# Altium schematic sheet CPU.SchDoc
size A3; SheetNumber: 3; SheetTotal: 7
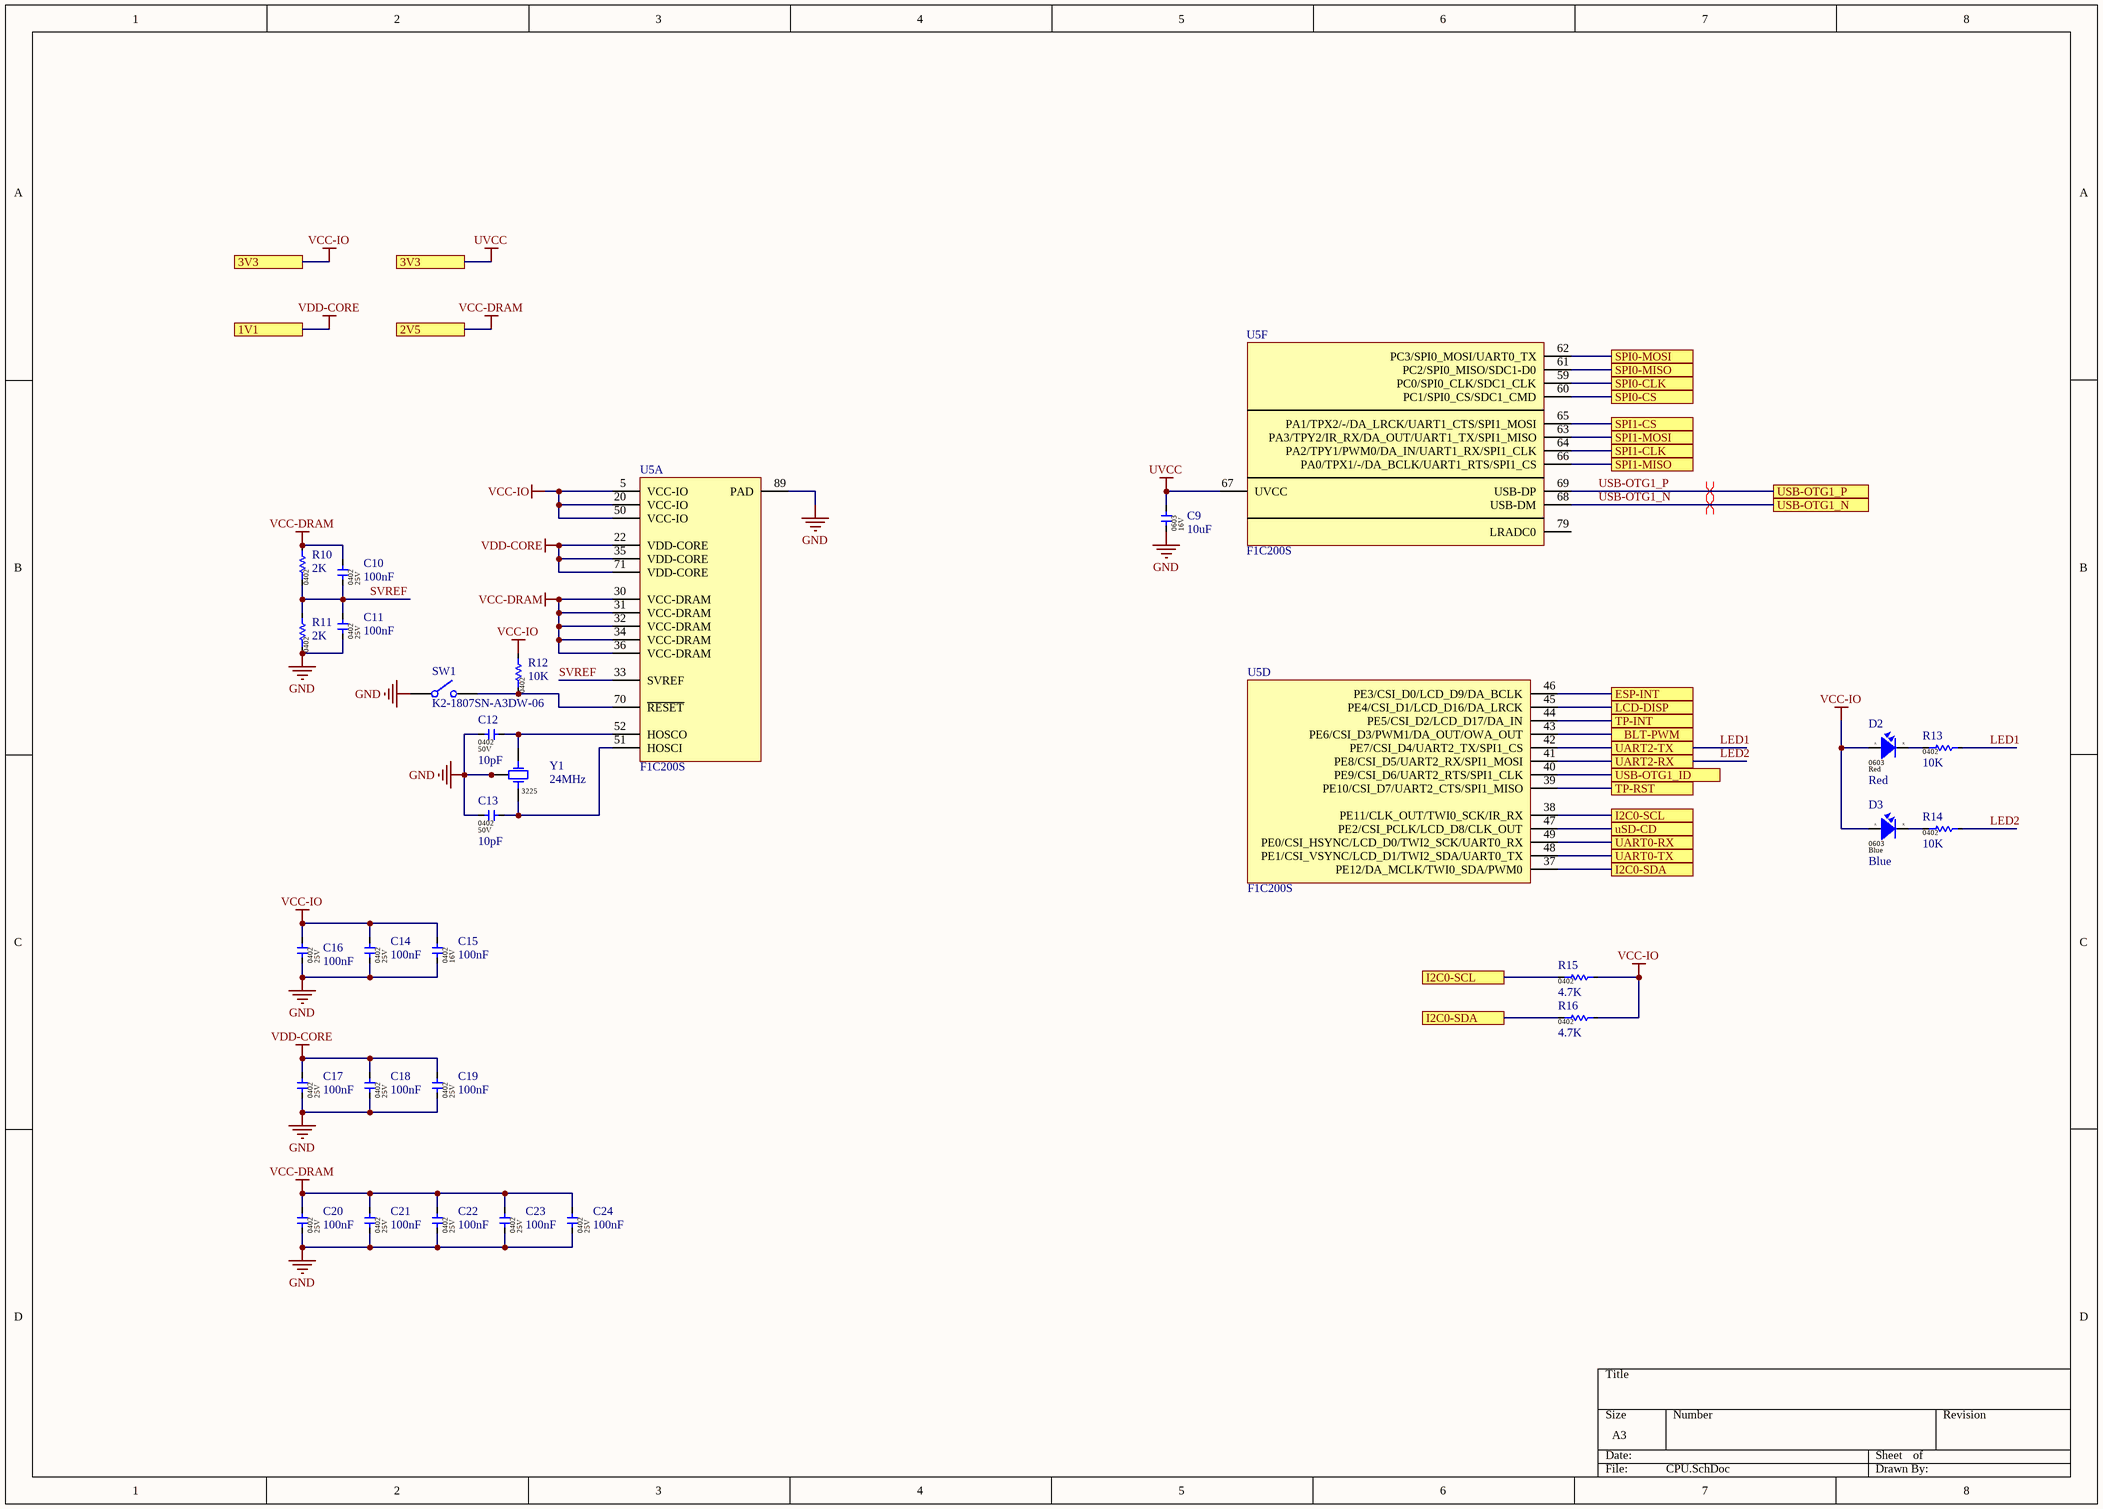
[diagram p0: CPU.SchDoc]

## Parts
C9  10uF  [CAP-0603]
C10  100nF  [CAP-0402]
C11  100nF  [CAP-0402]
C12  10pF  [CAP-0402]
C13  10pF  [CAP-0402]
C14  100nF  [CAP-0402]
C15  100nF  [CAP-0402]
C16  100nF  [CAP-0402]
C17  100nF  [CAP-0402]
C18  100nF  [CAP-0402]
C19  100nF  [CAP-0402]
C20  100nF  [CAP-0402]
C21  100nF  [CAP-0402]
C22  100nF  [CAP-0402]
C23  100nF  [CAP-0402]
C24  100nF  [CAP-0402]
D2  Red  [LED-0603 RED]
D3  Blue  [LED-0603 BLUE]
R10  2K  [RES-0402]
R11  2K  [RES-0402]
R12  10K  [RES-0402]
R13  10K  [RES-0402]
R14  10K  [RES-0402]
R15  4.7K  [RES-0402]
R16  4.7K  [RES-0402]
SW1  K2-1807SN-A3DW-06  [SW - TYPE 3]
U5  F1C200S  [F1Cx00s]  (parts A,D,F of 6)
Y1  24MHz  [Crystal-3225]

## Ports
1V1, 2V5, 3V3, BLT-PWM, ESP-INT, I2C0-SCL, I2C0-SDA, LCD-DISP, SPI0-CLK, SPI0-CS, SPI0-MISO, SPI0-MOSI, SPI1-CLK, SPI1-CS, SPI1-MISO, SPI1-MOSI, TP-INT, TP-RST, UART0-RX, UART0-TX, UART2-RX, UART2-TX, USB-OTG1_ID, USB-OTG1_N, USB-OTG1_P, uSD-CD

## Nets
GND: C9.1 C11.1 C12.1 C13.1 C14.1 C15.1 C16.1 C17.1 C18.1 C19.1 C20.1 C21.1 C22.1 C23.1 C24.1 R11.1 SW1.1 U5.89(PAD) Y1.2(GND) Y1.4(GND)
UVCC: C9.2 C14.2 C15.2 C16.2 D2.2(Anode) D3.2(Anode) R12.2 R15.2 R16.2 U5.5(VCC-IO) U5.20(VCC-IO) U5.50(VCC-IO) U5.67(UVCC) ; port 3V3  [also labelled VCC-IO]
VCC-DRAM: C10.2 C20.2 C21.2 C22.2 C23.2 C24.2 R10.2 U5.30(VCC-DRAM) U5.31(VCC-DRAM) U5.32(VCC-DRAM) U5.34(VCC-DRAM) U5.36(VCC-DRAM) ; port 2V5
VDD-CORE: C17.2 C18.2 C19.2 U5.22(VDD-CORE) U5.35(VDD-CORE) U5.71(VDD-CORE) ; port 1V1
BLT-PWM: U5.43(PE6/CSI_D3/PWM1/DA_OUT/OWA_OUT) ; port BLT-PWM
ESP-INT: U5.46(PE3/CSI_D0/LCD_D9/DA_BCLK) ; port ESP-INT
I2C0-SCL: R15.1 U5.38(PE11/CLK_OUT/TWI0_SCK/IR_RX) ; port I2C0-SCL
I2C0-SDA: R16.1 U5.37(PE12/DA_MCLK/TWI0_SDA/PWM0) ; port I2C0-SDA
LCD-DISP: U5.45(PE4/CSI_D1/LCD_D16/DA_LRCK) ; port LCD-DISP
LED1: R13.2 U5.42(PE7/CSI_D4/UART2_TX/SPI1_CS) ; port UART2-TX
LED2: R14.2 U5.41(PE8/CSI_D5/UART2_RX/SPI1_MOSI) ; port UART2-RX
SPI0-CLK: U5.59(PC0/SPI0_CLK/SDC1_CLK) ; port SPI0-CLK
SPI0-CS: U5.60(PC1/SPI0_CS/SDC1_CMD) ; port SPI0-CS
SPI0-MISO: U5.61(PC2/SPI0_MISO/SDC1-D0) ; port SPI0-MISO
SPI0-MOSI: U5.62(PC3/SPI0_MOSI/UART0_TX) ; port SPI0-MOSI
SPI1-CLK: U5.64(PA2/TPY1/PWM0/DA_IN/UART1_RX/SPI1_CLK) ; port SPI1-CLK
SPI1-CS: U5.65(PA1/TPX2/-/DA_LRCK/UART1_CTS/SPI1_MOSI) ; port SPI1-CS
SPI1-MISO: U5.66(PA0/TPX1/-/DA_BCLK/UART1_RTS/SPI1_CS) ; port SPI1-MISO
SPI1-MOSI: U5.63(PA3/TPY2/IR_RX/DA_OUT/UART1_TX/SPI1_MISO) ; port SPI1-MOSI
SVREF: C10.1 C11.2 R10.1 R11.2 U5.33(SVREF)
TP-INT: U5.44(PE5/CSI_D2/LCD_D17/DA_IN) ; port TP-INT
TP-RST: U5.39(PE10/CSI_D7/UART2_CTS/SPI1_MISO) ; port TP-RST
UART0-RX: U5.49(PE0/CSI_HSYNC/LCD_D0/TWI2_SCK/UART0_RX) ; port UART0-RX
UART0-TX: U5.48(PE1/CSI_VSYNC/LCD_D1/TWI2_SDA/UART0_TX) ; port UART0-TX
USB-OTG1_ID: U5.40(PE9/CSI_D6/UART2_RTS/SPI1_CLK) ; port USB-OTG1_ID
USB-OTG1_N: U5.68(USB-DM) ; port USB-OTG1_N
USB-OTG1_P: U5.69(USB-DP) ; port USB-OTG1_P
uSD-CD: U5.47(PE2/CSI_PCLK/LCD_D8/CLK_OUT) ; port uSD-CD
NetC12_2: C12.2 U5.52(HOSCO) Y1.1(X1)
NetC13_2: C13.2 U5.51(HOSCI) Y1.3(X2)
NetD2_1: D2.1(Cathode) R13.1
NetD3_1: D3.1(Cathode) R14.1
NetR12_1: R12.1 SW1.2 U5.70(~{RESET})

Not connected (* = marked no-connect by the designer): U5 79(LRADC0)

## Layout directives
differential pair; differential pair class DIFF90_USB: USB-OTG1_N, USB-OTG1_P

## Notes on the sheet
- (in symbol 19-217/BHC-ZL1M2RY/3T) A; K
- (in symbol 19-217/R6C-AL1M2VY/3T) A; K

## Library data of the parts
C9 = 0603X106M160CT: 16V 10uF X5R ±20% 0603 Multilayer Ceramic Capacitors MLCC - SMD/SMT ROHS; Manufacture: WALSIN; Package / Case: 0402; Component type: Capacitor; Manufacture part: 0603X106M160CT; Capacitor value: 10uF; Voltage: 16V; Package: 0603
C10 C11 C14 C16-C24 = 0402X104K250CT: 100nF ±10% 25V X5R 0402 Multilayer Ceramic Capacitors MLCC - SMD/SMT RoHS; Manufacture: WALSIN; Package / Case: 0402; Component type: Capacitor; Manufacture part: 0402X104K250CT; Capacitor value: 100nF; Voltage: 25V; Package: 0402
C12 C13 = 0402N100J500CT: 10pF ±5% 50V NP0 0402 Multilayer Ceramic Capacitors MLCC - SMD/SMT RoHS; Manufacture: WALSIN; Package / Case: 0402; Component type: Capacitor; Manufacture part: 0402N100J500CT; Capacitor value: 10pF; Voltage: 50V; Package: 0402
C15 = 0402B104K160CT: 100nF ±10% 16V X7R 0402 Multilayer Ceramic Capacitors MLCC - SMD/SMT RoHS; Manufacture: WALSIN; Package / Case: 0402; Component type: Capacitor; Manufacture part: 0402B104K160CT; Capacitor value: 100nF; Voltage: 16V; Package: 0402
D2 = 19-217/R6C-AL1M2VY/3T: Red 617.5~633.5nm 0603 Light Emitting Diodes (LED) RoHS; Manufacture: Everlight Elec; Package / Case: 0402; Component type: Led; Part reference: *; Manufacture part: 19-217/R6C-AL1M2VY/3T; Color: Red; Package: 0603
D3 = 19-217/BHC-ZL1M2RY/3T: Blue 465~475nm 0603 Light Emitting Diodes (LED) RoHS; Manufacture: Everlight Elec; Package / Case: 0402; Component type: Led; Part reference: *; Manufacture part: 19-217/BHC-ZL1M2RY/3T; Color: Blue; Package: 0603
R10 R11 = WR04X2001FTL: 2kΩ ±1% 1/16W ±100ppm/℃ 0402 Chip Resistor - Surface Mount RoHS; Manufacture: WALSIN; Package / Case: 0201; Component type: Resistor; Manufacture part: WR04X2001FTL; Resistor value: 2K; Package: 0402
R12-R14 = WR04X1002FTL: 10kΩ ±1% 1/16W ±100ppm/℃ 0402 Chip Resistor - Surface Mount RoHS; Manufacture: WALSIN; Package / Case: 0201; Component type: Resistor; Manufacture part: WR04X1002FTL; Resistor value: 10K; Package: 0402
R15 R16 = WR04X4701FTL: 4.7kΩ ±1% 1/16W ±100ppm/℃ 0402 Chip Resistor - Surface Mount RoHS; Manufacture: WALSIN; Package / Case: 0201; Component type: Resistor; Manufacture part: WR04X4701FTL; Resistor value: 4.7K; Package: 0402
SW1 = K2-1807SN-A3DW-06: SMD,3×4×2.0mm Tactile Switches RoHS; Manufacture: Korean Hroparts Elec; Manufacture part: K2-1807SN-A3DW-06; Type: Tactile Switches; Datasheet: https://datasheet.lcsc.com/lcsc/2008221234_XUNPU-TS-1088-AR02016_C720477.pdf
U5 = F1C200S: The Allwinner F1C200s is a small SoC with an ARM926EJ-S CPU core and 64MB of embedded DDR SDRAM.; Manufacture part: F1C200S; Manufacture: Allwinner; Package: QFN-88 (10x10); Datasheet: https://linux-sunxi.org/images/1/11/Allwinner_F1C200s_Datasheet_V1.0.pdf
Y1 = SX32Y024000BC1T: 24MHz ±10ppm 12pF 40Ω SMD-3225 Crystals RoHS; Manufacture: TKD; Manufacture part: SX32Y024000BC1T; Crystal value: 24MHz; Package: 3225